# Altium schematic sheet 2.WIZ750SR_Transceiver.SchDoc
size A4; DrawnBy: Peter; Organization: WIZnet Co., Ltd.; Address1: 5F, Humax Village; Address2: Hwangseaul-ro, Bundang-Gu; Address3: Seongnam-Si, Gyeonggi-Do; Address4: South Korea; Team: Wiki
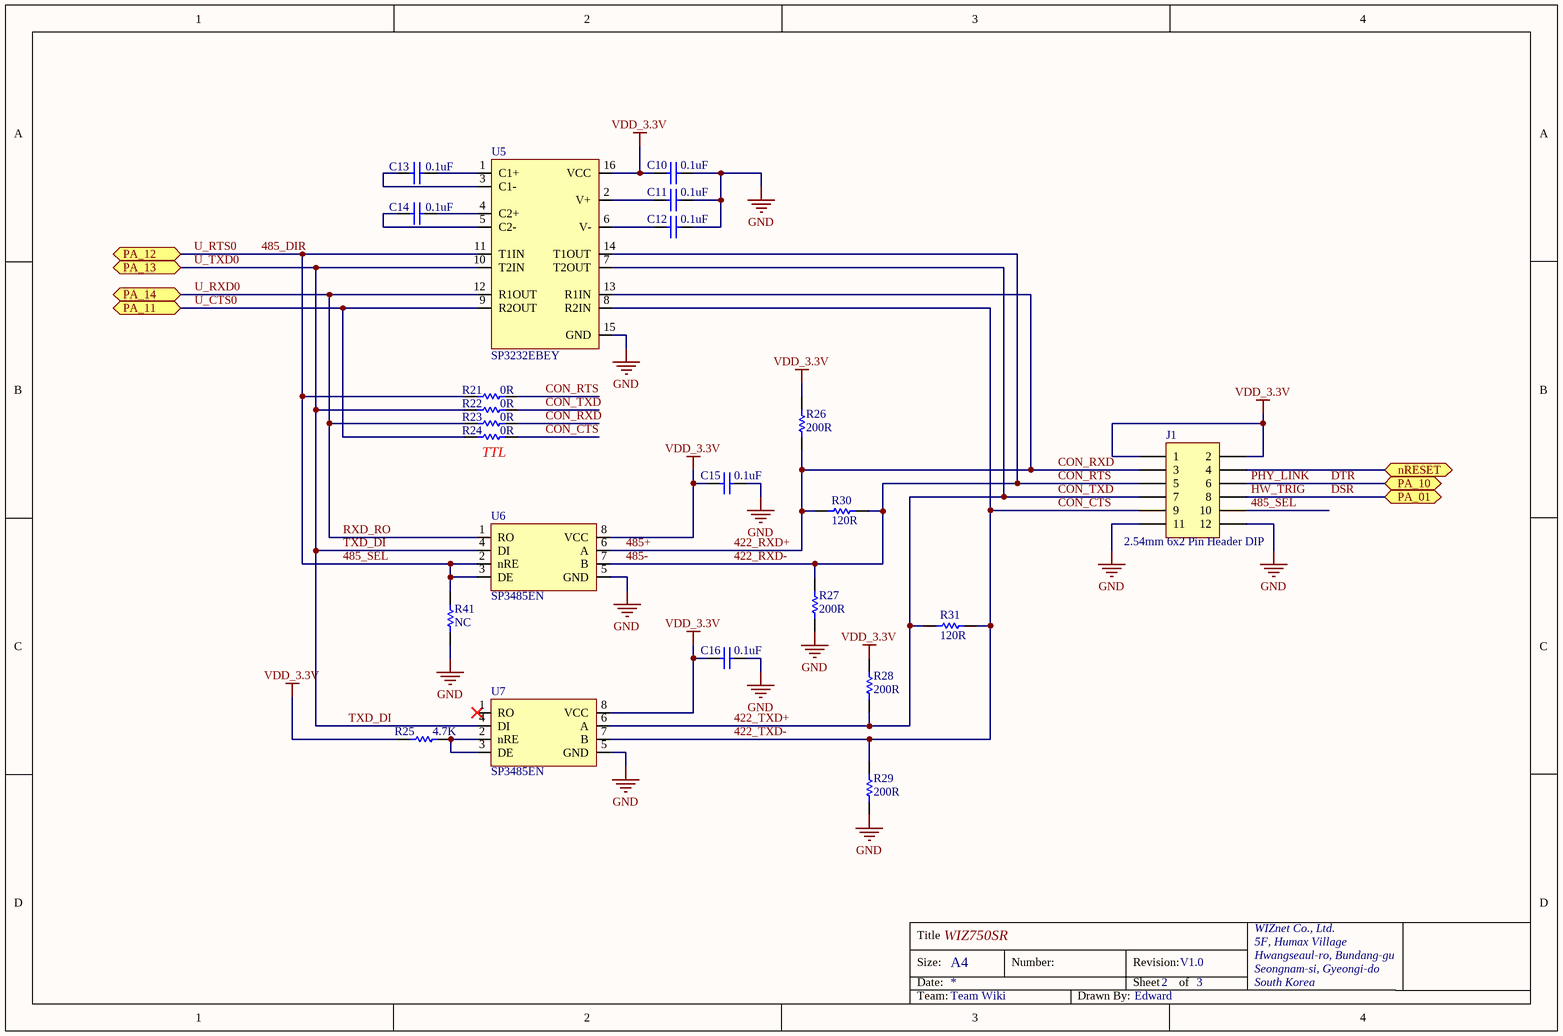
[diagram p0: 2.WIZ750SR_Transceiver.SchDoc]

## Parts
C10  0.1uF  [CAP-0402]
C11  0.1uF  [CAP-0402]
C12  0.1uF  [CAP-0402]
C13  0.1uF  [CAP-0402]
C14  0.1uF  [CAP-0402]
C15  0.1uF  [CAP-0402]
C16  0.1uF  [CAP-0402]
J1  2.54mm 6x2 Pin Header DIP  [IDC-2X6]
R21  0R  [RES-0402]
R22  0R  [RES-0402]
R23  0R  [RES-0402]
R24  0R  [RES-0402]
R25  4.7K  [RES-0402]
R26  200R  [RES-0402]
R27  200R  [RES-0402]
R28  200R  [RES-0402]
R29  200R  [RES-0402]
R30  120R  [RES-0402]
R31  120R  [RES-0402]
R41  NC  [RES-0402]
U5  SP3232EBEY  [TSSOP16(0.65/6.4)]
U6  SP3485EN  [SO-08]
U7  SP3485EN  [SO-08]

## Ports
nRESET, PA_01, PA_10, PA_11, PA_12, PA_13, PA_14

## Nets
GND: C10.1 C11.1 C12.1 C15.1 C16.1 J1.11 J1.12 R27.2 R29.2 R41.2 U5.15(GND) U6.5(GND) U7.5(GND)
VDD_3.3V: C10.2 C15.2 C16.2 J1.1 J1.2 R25.2 R26.1 R28.1 U5.16(VCC) U6.8(VCC) U7.8(VCC)
422_RXD+: J1.3 R23.1 R26.2 R30.2 U5.13(R1IN) U6.6(A)  [also labelled 485+, CON_RXD]
422_RXD-: J1.5 R21.1 R27.1 R30.1 U5.14(T1OUT) U6.7(B)  [also labelled 485-, CON_RTS]
422_TXD+: J1.7 R22.1 R28.2 R31.2 U5.7(T2OUT) U7.6(A)  [also labelled CON_TXD]
422_TXD-: J1.9 R24.1 R29.1 R31.1 U5.8(R2IN) U7.7(B)  [also labelled CON_CTS]
485_DIR: J1.10 R21.2 R41.1 U5.11(T1IN) U6.2(nRE) U6.3(DE) ; port PA_12  [also labelled 485_SEL, U_RTS0]
DSR: J1.8 ; port PA_01  [also labelled HW_TRIG]
DTR: J1.6 ; port PA_10  [also labelled PHY_LINK]
nRESET: J1.4 ; port nRESET
RXD_RO: R23.2 U5.12(R1OUT) U6.1(RO) ; port PA_14  [also labelled U_RXD0]
TXD_DI: R22.2 U5.10(T2IN) U6.4(DI) U7.4(DI) ; port PA_13  [also labelled U_TXD0]
U_CTS0: R24.2 U5.9(R2OUT) ; port PA_11
NetC11_2: C11.2 U5.2(V+)
NetC12_2: C12.2 U5.6(V-)
NetC13_1: C13.1 U5.1(C1+)
NetC13_2: C13.2 U5.3(C1-)
NetC14_1: C14.1 U5.4(C2+)
NetC14_2: C14.2 U5.5(C2-)
NetR25_1: R25.1 U7.2(nRE) U7.3(DE)

Not connected (* = marked no-connect by the designer): U7 1(RO)*

## Notes on the sheet
- (near R24) TTL
- Title
- Size:
- Date:
- WIZ750SR
- A4
- Number:
- Revision:
- Sheet
- 2
- of
- V1.0
- 3
- WIZnet Co., Ltd.
- 5F, Humax Village
- Hwangseaul-ro, Bundang-gu
- Seongnam-si, Gyeongi-do
- South Korea
- Team:
- Team Wiki
- Drawn By:
- Edward

## Library data of the parts
C10-C16 = CAP-0402: Ceramic CAP 0402(1005)
J1 = Header 6X2: Header, 6-Pin, Dual row; LatestRevisionDate: 17-Jul-2002; LatestRevisionNote: Re-released for DXP Platform.; Publisher: Altium Limited
R21-R31 R41 = RES-0402
U5 = SP3232EBEY: True +3.0V to +5.5V RS-232 Transceivers TSSOP16
U6 U7 = SP3485EN: SP3485EN SOIC8